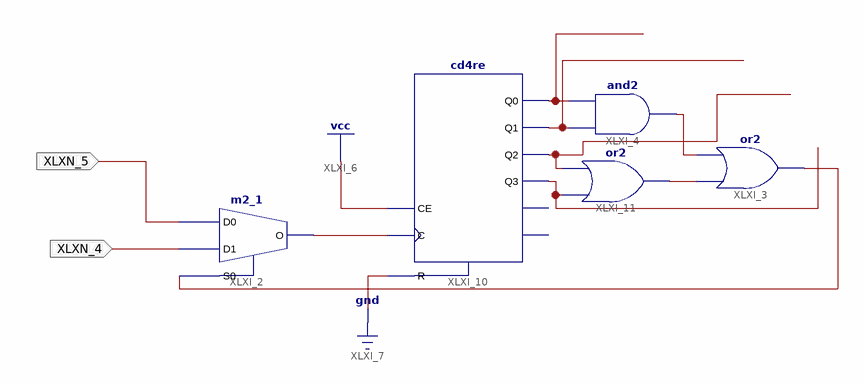
[diagram p0: schematic sheet 1]
// Xilinx ISE schematic res.sch (spartan6) as structural Verilog: 5 symbols, 2 ports
module res (
  input  XLXN_4,
  input  XLXN_5
);

  wire XLXN_3, XLXN_9, XLXN_12, XLXN_20, XLXN_22, XLXN_24, XLXN_25, XLXN_26;

  m2_1 XLXI_2 (.D0(XLXN_5), .D1(XLXN_4), .S0(XLXN_3), .O(XLXN_12));
  or XLXI_3 (XLXN_3, XLXN_22, XLXN_9);
  and XLXI_4 (XLXN_9, XLXN_25, XLXN_24);
  cd4re XLXI_10 (
    .C(XLXN_12), .CE(1'b1), .R(1'b0), .Q0(XLXN_24), .Q1(XLXN_25), .Q2(XLXN_26), .Q3(XLXN_20));  // open: CEO, TC
  or XLXI_11 (XLXN_22, XLXN_20, XLXN_26);
endmodule
